# EAGLE design solenoid-shield (EAGLE 9.6.2)

## Sheet 1 of 3
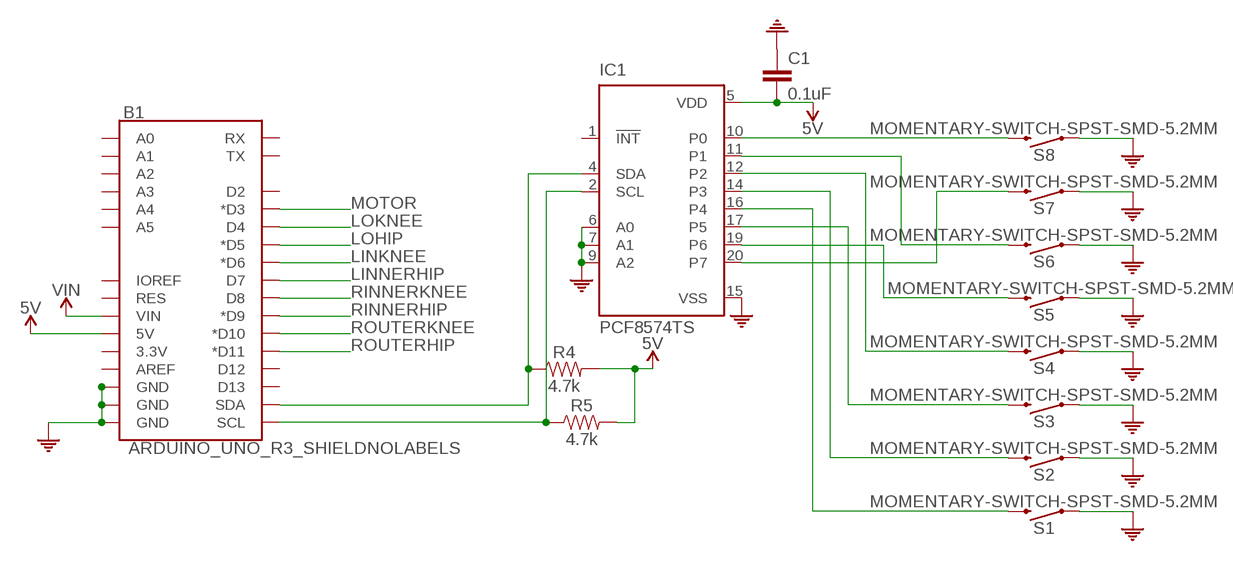
[diagram p0: schematic, sheet 1]

### Parts
B1  ARDUINO_UNO_R3_SHIELDNOLABELS  [UNO_R3_SHIELD_NOLABELS]
C1  0.1uF  0.1UF-0603-25V-5%  [0603]
IC1  PCF8574TS  [SSOP20]
R4  4.7k  4.7KOHM-0603-1/10W-1%  [0603]
R5  4.7k  4.7KOHM-0603-1/10W-1%  [0603]
S1  MOMENTARY-SWITCH-SPST-SMD-5.2MM  [TACTILE_SWITCH_SMD_5.2MM]
S2  MOMENTARY-SWITCH-SPST-SMD-5.2MM  [TACTILE_SWITCH_SMD_5.2MM]
S3  MOMENTARY-SWITCH-SPST-SMD-5.2MM  [TACTILE_SWITCH_SMD_5.2MM]
S4  MOMENTARY-SWITCH-SPST-SMD-5.2MM  [TACTILE_SWITCH_SMD_5.2MM]
S5  MOMENTARY-SWITCH-SPST-SMD-5.2MM  [TACTILE_SWITCH_SMD_5.2MM]
S6  MOMENTARY-SWITCH-SPST-SMD-5.2MM  [TACTILE_SWITCH_SMD_5.2MM]
S7  MOMENTARY-SWITCH-SPST-SMD-5.2MM  [TACTILE_SWITCH_SMD_5.2MM]
S8  MOMENTARY-SWITCH-SPST-SMD-5.2MM  [TACTILE_SWITCH_SMD_5.2MM]

### Nets
5V: B1.5V C1.2 IC1.5(VDD) R4.2 R5.2
COM: B1.GND@0(GND) B1.GND@1(GND) B1.GND@2(GND) C1.1 IC1.6(A0) IC1.7(A1) IC1.9(A2) IC1.15(VSS) S1.1 S2.1 S3.1 S4.1 S5.1 S6.1 S7.1 S8.1 ; also sheet 2
LINKNEE: B1.D6(*D6) ; also sheet 2
LINNERHIP: B1.D7 ; also sheet 2
LOHIP: B1.D5(*D5) ; also sheet 2
LOKNEE: B1.D4 ; also sheet 2
MOTOR: B1.D3(*D3) ; also sheet 2
N$9: IC1.10(P0) S8.3
N$11: IC1.20(P7) S7.3
N$13: B1.SDA IC1.4(SDA) R4.1
N$26: IC1.11(P1) S6.3
N$29: IC1.19(P6) S5.3
N$31: IC1.12(P2) S4.3
N$32: IC1.17(P5) S3.3
N$33: IC1.14(P3) S2.3
N$34: IC1.16(P4) S1.3
N$49: B1.SCL IC1.2(SCL) R5.1
RINNERHIP: B1.D9(*D9) ; also sheet 2
RINNERKNEE: B1.D8 ; also sheet 2
ROUTERHIP: B1.D11(*D11) ; also sheet 2
ROUTERKNEE: B1.D10(*D10) ; also sheet 2
VIN: B1.VIN ; also sheet 2
Unconnected: B1.3.3V B1.A0 B1.A1 B1.A2 B1.A3 B1.A4 B1.A5 B1.AREF B1.D2 B1.D12 B1.D13 B1.IOREF B1.RES B1.RX B1.TX IC1.1(!INT)

## Sheet 2 of 3
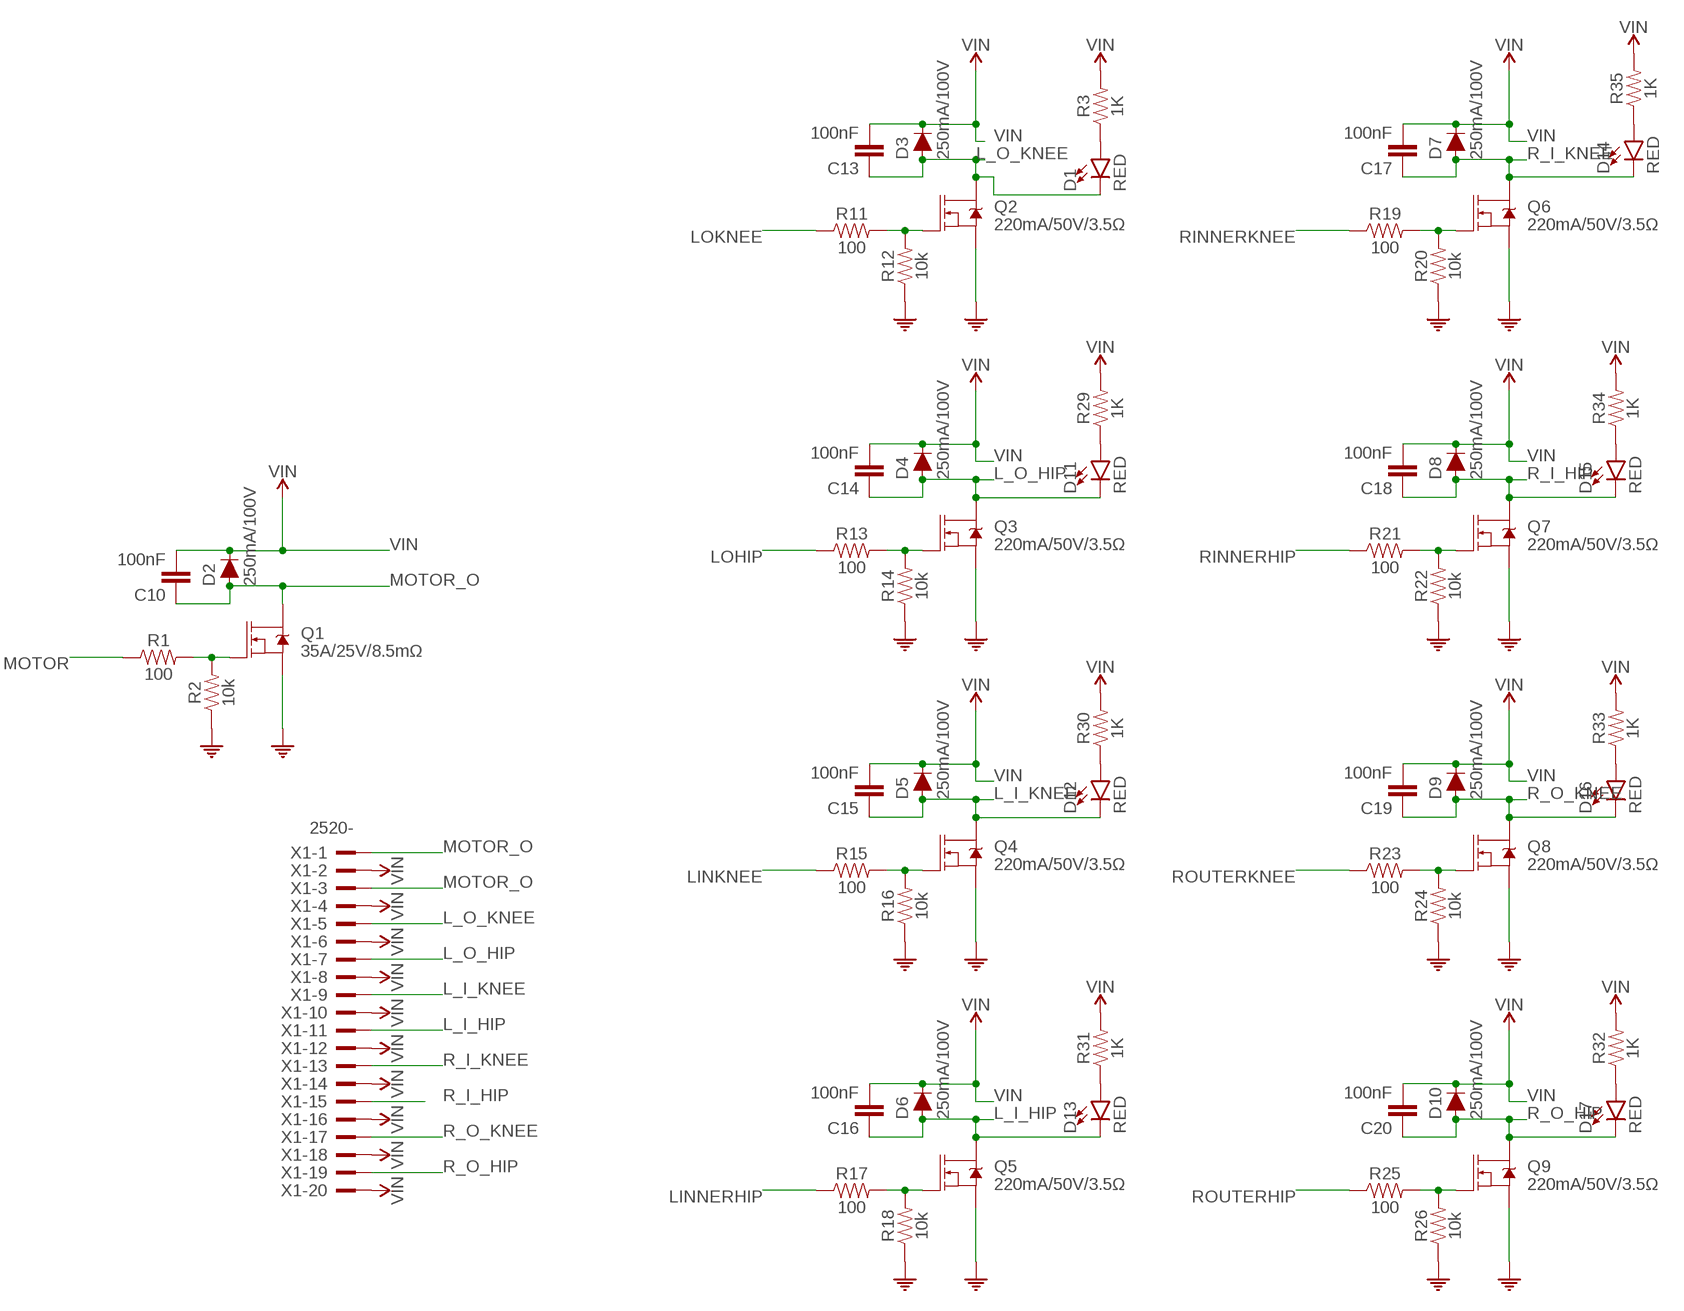
[diagram p1: schematic, sheet 2]

### Parts
C10  100nF  0015_100NF_0603  [C0603-ROUND]
C13  100nF  0015_100NF_0603  [C0603-ROUND]
C14  100nF  0015_100NF_0603  [C0603-ROUND]
C15  100nF  0015_100NF_0603  [C0603-ROUND]
C16  100nF  0015_100NF_0603  [C0603-ROUND]
C17  100nF  0015_100NF_0603  [C0603-ROUND]
C18  100nF  0015_100NF_0603  [C0603-ROUND]
C19  100nF  0015_100NF_0603  [C0603-ROUND]
C20  100nF  0015_100NF_0603  [C0603-ROUND]
D1  RED  LED-RED0603  [LED-0603]
D2  250mA/100V  DIODE-BAS16J  [SOD-323]
D3  250mA/100V  DIODE-BAS16J  [SOD-323]
D4  250mA/100V  DIODE-BAS16J  [SOD-323]
D5  250mA/100V  DIODE-BAS16J  [SOD-323]
D6  250mA/100V  DIODE-BAS16J  [SOD-323]
D7  250mA/100V  DIODE-BAS16J  [SOD-323]
D8  250mA/100V  DIODE-BAS16J  [SOD-323]
D9  250mA/100V  DIODE-BAS16J  [SOD-323]
D10  250mA/100V  DIODE-BAS16J  [SOD-323]
D11  RED  LED-RED0603  [LED-0603]
D12  RED  LED-RED0603  [LED-0603]
D13  RED  LED-RED0603  [LED-0603]
D14  RED  LED-RED0603  [LED-0603]
D15  RED  LED-RED0603  [LED-0603]
D16  RED  LED-RED0603  [LED-0603]
D17  RED  LED-RED0603  [LED-0603]
Q1  35A/25V/8.5mΩ  MOSFET-NCH-FDD8780  [DPAK]
Q2  220mA/50V/3.5Ω  MOSFET-NCH-BSS138  [SOT23-3]
Q3  220mA/50V/3.5Ω  MOSFET-NCH-BSS138  [SOT23-3]
Q4  220mA/50V/3.5Ω  MOSFET-NCH-BSS138  [SOT23-3]
Q5  220mA/50V/3.5Ω  MOSFET-NCH-BSS138  [SOT23-3]
Q6  220mA/50V/3.5Ω  MOSFET-NCH-BSS138  [SOT23-3]
Q7  220mA/50V/3.5Ω  MOSFET-NCH-BSS138  [SOT23-3]
Q8  220mA/50V/3.5Ω  MOSFET-NCH-BSS138  [SOT23-3]
Q9  220mA/50V/3.5Ω  MOSFET-NCH-BSS138  [SOT23-3]
R1  100  100OHM-0603-1/10W-1%  [0603]
R2  10k  10KOHM-0603-1/10W-1%  [0603]
R3  1K  10KOHM-0603-1/10W-1%  [0603]
R11  100  100OHM-0603-1/10W-1%  [0603]
R12  10k  10KOHM-0603-1/10W-1%  [0603]
R13  100  100OHM-0603-1/10W-1%  [0603]
R14  10k  10KOHM-0603-1/10W-1%  [0603]
R15  100  100OHM-0603-1/10W-1%  [0603]
R16  10k  10KOHM-0603-1/10W-1%  [0603]
R17  100  100OHM-0603-1/10W-1%  [0603]
R18  10k  10KOHM-0603-1/10W-1%  [0603]
R19  100  100OHM-0603-1/10W-1%  [0603]
R20  10k  10KOHM-0603-1/10W-1%  [0603]
R21  100  100OHM-0603-1/10W-1%  [0603]
R22  10k  10KOHM-0603-1/10W-1%  [0603]
R23  100  100OHM-0603-1/10W-1%  [0603]
R24  10k  10KOHM-0603-1/10W-1%  [0603]
R25  100  100OHM-0603-1/10W-1%  [0603]
R26  10k  10KOHM-0603-1/10W-1%  [0603]
R29  1K  10KOHM-0603-1/10W-1%  [0603]
R30  1K  10KOHM-0603-1/10W-1%  [0603]
R31  1K  10KOHM-0603-1/10W-1%  [0603]
R32  1K  10KOHM-0603-1/10W-1%  [0603]
R33  1K  10KOHM-0603-1/10W-1%  [0603]
R34  1K  10KOHM-0603-1/10W-1%  [0603]
R35  1K  10KOHM-0603-1/10W-1%  [0603]
X1  2520-  [PAK100/2500-20]

### Nets
COM: Q1.3(S) Q2.2(S) Q3.2(S) Q4.2(S) Q5.2(S) Q6.2(S) Q7.2(S) Q8.2(S) Q9.2(S) R2.1 R12.1 R14.1 R16.1 R18.1 R20.1 R22.1 R24.1 R26.1 ; also sheet 1
L_I_HIP: C16.1 D6.A D13.C Q5.3(D) X1.11
L_I_KNEE: C15.1 D5.A D12.C Q4.3(D) X1.9
L_O_HIP: C14.1 D4.A D11.C Q3.3(D) X1.7
L_O_KNEE: C13.1 D1.C D3.A Q2.3(D) X1.5
LINKNEE: R15.1 ; also sheet 1
LINNERHIP: R17.1 ; also sheet 1
LOHIP: R13.1 ; also sheet 1
LOKNEE: R11.1 ; also sheet 1
MOTOR: R1.1 ; also sheet 1
MOTOR_O: C10.1 D2.A Q1.4(D) X1.1 X1.3
N$1: D1.A R3.1
N$2: D11.A R29.1
N$3: D12.A R30.1
N$4: D13.A R31.1
N$5: D17.A R32.1
N$6: D16.A R33.1
N$7: D15.A R34.1
N$8: D14.A R35.1
N$10: Q1.1(G) R1.2 R2.2
N$12: Q2.1(G) R11.2 R12.2
N$15: Q3.1(G) R13.2 R14.2
N$17: Q4.1(G) R15.2 R16.2
N$19: Q5.1(G) R17.2 R18.2
N$21: Q6.1(G) R19.2 R20.2
N$23: Q7.1(G) R21.2 R22.2
N$25: Q8.1(G) R23.2 R24.2
N$28: Q9.1(G) R25.2 R26.2
R_I_HIP: C18.1 D8.A D15.C Q7.3(D) X1.15
R_I_KNEE: C17.1 D7.A D14.C Q6.3(D) X1.13
R_O_HIP: C20.1 D10.A D17.C Q9.3(D) X1.19
R_O_KNEE: C19.1 D9.A D16.C Q8.3(D) X1.17
RINNERHIP: R21.1 ; also sheet 1
RINNERKNEE: R19.1 ; also sheet 1
ROUTERHIP: R25.1 ; also sheet 1
ROUTERKNEE: R23.1 ; also sheet 1
VIN: C10.2 C13.2 C14.2 C15.2 C16.2 C17.2 C18.2 C19.2 C20.2 D2.C D3.C D4.C D5.C D6.C D7.C D8.C D9.C D10.C R3.2 R29.2 R30.2 R31.2 R32.2 R33.2 R34.2 R35.2 X1.2 X1.4 X1.6 X1.8 X1.10 X1.12 X1.14 X1.16 X1.18 X1.20 ; also sheet 1

## Sheet 3 of 3

## Library data of the parts
B1 = SparkFun-Boards:ARDUINO_UNO_R3_SHIELD: Arduino R3 Shield Footprint Shield form compatible with the Arduino Uno R3. SparkFun Products: MG2639 Cellular Shield <https://www.sparkfun.com/products/13120> MIDI Shield <https://www.sparkfun.com/products/12898> R3 Stackable Headers Kit <https://www.sparkfun.com/products/11417>
C1 = SparkFun-Capacitors:0.1UF: 0.1µF ceramic capacitors A capacitor is a passive two-terminal electrical component used to store electrical energy temporarily in an electric field.; PROD_ID: CAP-08604
C10 C13-C20 = Condensatori:0015_100NF_0603: 100nF 0603 50V; CASE: 0603; MONTHLY_USAGE: _____; PART_NUMBER: cl10b104kbnc; PRICE: _____; SUPPLIER: _____; TYPE: Condensatori
D1 D11-D17 = SparkFun-LED:LED-RED: Red SMD LED Used in manufacturing of most products at SparkFun Packages: 0603 - SMD 0603 package [Product Link] <http://docs.avagotech.com/docs/AV02-0551EN> 0603 SMART - SMD 0603 SMART package ( more efficient and expensive)[Product Link] <http://www.osram-os.com/Graphics/XPic2/00077099_0.pdf> 1206 - SMD1206 package [Product Link] <https://www.sparkfun.com/datasheets/DevTools/LilyPad/Q150OVS4.pdff> SparkFun Products: Pro Mini 328 -5V <https://www.sparkfun.com/products/821> RedBoard <https://www.sparkfun.com/products/12757> IOIO-OTG <https://www.sparkfun.com/products/13613>; PROD_ID: DIO-00819
D2-D10 = SparkFun-DiscreteSemi:DIODE: Diode These are standard reverse protection diodes and small signal diodes. SparkFun Products: SparkFun SparkPunk Sound Kit <https://www.sparkfun.com/products/11177> SparkFun ESP8266 Thing <https://www.sparkfun.com/products/13231>; PROD_ID: DIO-09646
IC1 = micro-philips:PCF8574: I2C-Bus Remote 8-bit I/O expander http://www.semiconductors.philips.com/acrobat_download/datasheets/PCF8574_4.pdf; MPN: PCF8574TS/3,118; OC_FARNELL: 1506644; OC_NEWARK: 70R6873
Q1 = SparkFun-DiscreteSemi:MOSFET-NCH: N-channel MOSFETs Voltage controlled devices that allow control of high current outputs. SparkFun Products: SparkFun OpenScale <https://www.sparkfun.com/products/13261> SparkFun Digital Sandbox <https://www.sparkfun.com/products/12651> SparkFun Monster Moto Shield <https://www.sparkfun.com/products/10182> SparkFun MOSFET Power Controller <https://www.sparkfun.com/products/11214>; PROD_ID: TRANS-09984
Q2-Q9 = SparkFun-DiscreteSemi:MOSFET-NCH: N-channel MOSFETs Voltage controlled devices that allow control of high current outputs. SparkFun Products: SparkFun OpenScale <https://www.sparkfun.com/products/13261> SparkFun Digital Sandbox <https://www.sparkfun.com/products/12651> SparkFun Monster Moto Shield <https://www.sparkfun.com/products/10182> SparkFun MOSFET Power Controller <https://www.sparkfun.com/products/11214>; PROD_ID: TRANS-00830
R1 R11 R13 R15 R17 R19 R21 R23 R25 = SparkFun-Resistors:100OHM: 100Ω resistor A resistor is a passive two-terminal electrical component that implements electrical resistance as a circuit element. Resistors act to reduce current flow, and, at the same time, act to lower voltage levels within circuits. - Wikipedia; PROD_ID: RES-07863
R2 R12 R14 R16 R18 R20 R22 R24 R26 = SparkFun-Resistors:10KOHM: 10kΩ resistor A resistor is a passive two-terminal electrical component that implements electrical resistance as a circuit element. Resistors act to reduce current flow, and, at the same time, act to lower voltage levels within circuits. - Wikipedia; PROD_ID: RES-00824
R3 R29-R35 = SparkFun-Resistors:10KOHM: 10kΩ resistor A resistor is a passive two-terminal electrical component that implements electrical resistance as a circuit element. Resistors act to reduce current flow, and, at the same time, act to lower voltage levels within circuits. - Wikipedia; PROD_ID: RES-00824; VALUE: 10k
R4 R5 = SparkFun-Resistors:4.7KOHM: 4.7kΩ resistor A resistor is a passive two-terminal electrical component that implements electrical resistance as a circuit element. Resistors act to reduce current flow, and, at the same time, act to lower voltage levels within circuits. - Wikipedia; PROD_ID: RES-07857
S1-S8 = SparkFun-Switches:MOMENTARY-SWITCH-SPST: Momentary Switch (Pushbutton) - SPST Normally-open (NO) SPST momentary switches (buttons, pushbuttons). Variants PTH-12MM - 12mm square, through-hole Momentary Pushbutton Switch - 12mm Square <https://www.sparkfun.com/products/9190> (COM-09190) PTH-6.0MM, PTH-6.0MM-KIT - 6.0mm square, through-hole Mini Pushbutton Switch <https://www.sparkfun.com/products/97> (COM-00097) KIT package intended for soldering kit's - only one side of pads' copper is exposed. PTH-RIGHT-ANGLE-KIT - Right-angle, through-hole Right Angle Tactile Button <https://www.sparkfun.com/products/10791> - Used on SparkFun BigTime Watch Kit <https://www.sparkfun.com/products/11734> SMD-12MM - 12mm square, surface-mount Tactile Button - SMD (12mm) <https://www.sparkfun.com/products/12993> (COM-12993) Used on SparkFun PicoBoard <https://www.sparkfun.com/products/11888> SMD-4.5MM - 4.5mm Square Trackball Switch Used on SparkFun Blackberry Trackballer Breakout <https://www.sparkfun.com/products/13169> SMD-4.6MMX2.8MM - 4.60mm x 2.80mm, surface mount Used on SparkFun SAMD21 Mini Breakout <https://www.sparkfun.com/products/13664> SMD-5.2MM, SMD-5.2-REDUNDANT - 5.2mm square, surface-mount Mini Pushbutton Switch - SMD <https://www.sparkfun.com/products/8720> (COM-08720) Used on Arduino Pro Mini <https://www.sparkfun.com/products/11114> REDUNDANT package connects both switch circuits together SMD-6.0X3.5MM - 6.0 x 3.5mm, surface mount Momentary Reset Switch SMD <https://www.sparkfun.com/products/8229> (COM-08229) SMD-6.2MM-TALL - 6.2mm square, surface mount Tactile Button - SMD (6mm) <https://www.sparkfun.com/products/12992> Used on SparkFun Digital Sandbox <https://www.sparkfun.com/products/12651> SMD-RIGHT-ANGLE - Right-angle, surface mount Used on SparkFun Block for Intel® Edison - Arduino <https://www.sparkfun.com/products/13036>; PROD_ID: SWCH-08247; SF_SKU: COM-08720
X1 = con-3m:2520-: 3M (TM) Pak 100 4-Wall Header Source: 3M; OC_FARNELL: unknown; OC_NEWARK: unknown

## Board
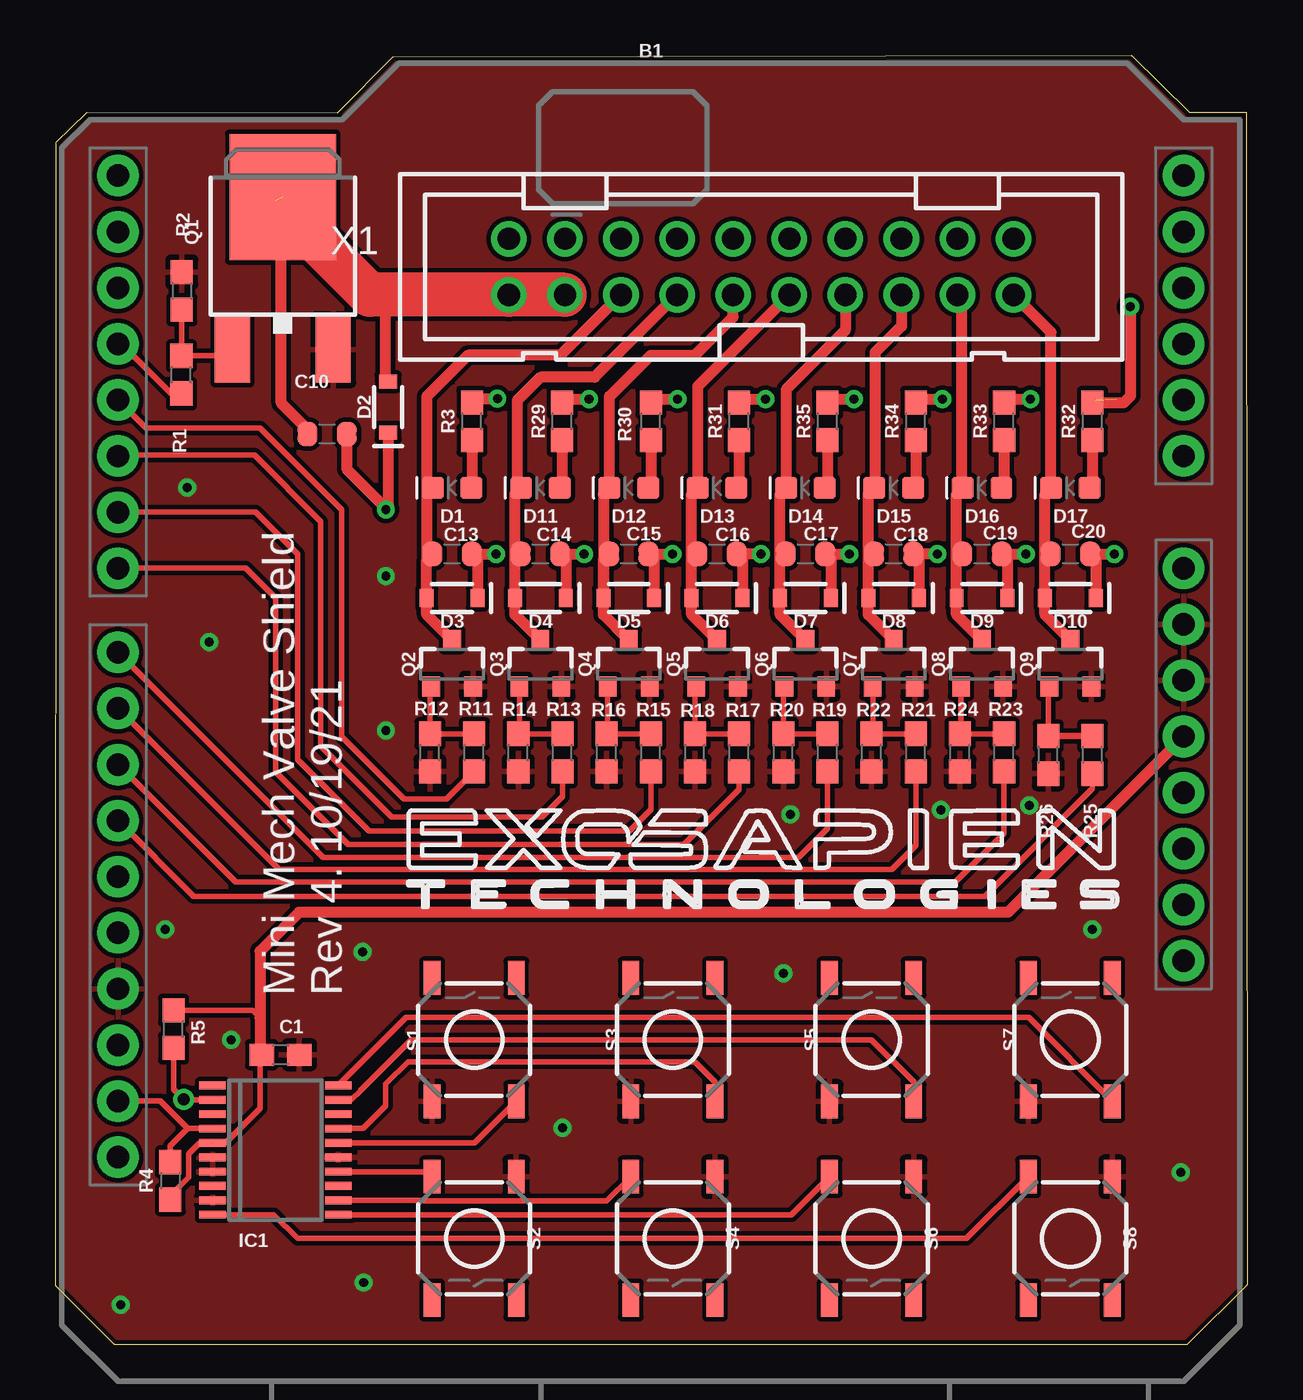
[diagram p2: board, top side]
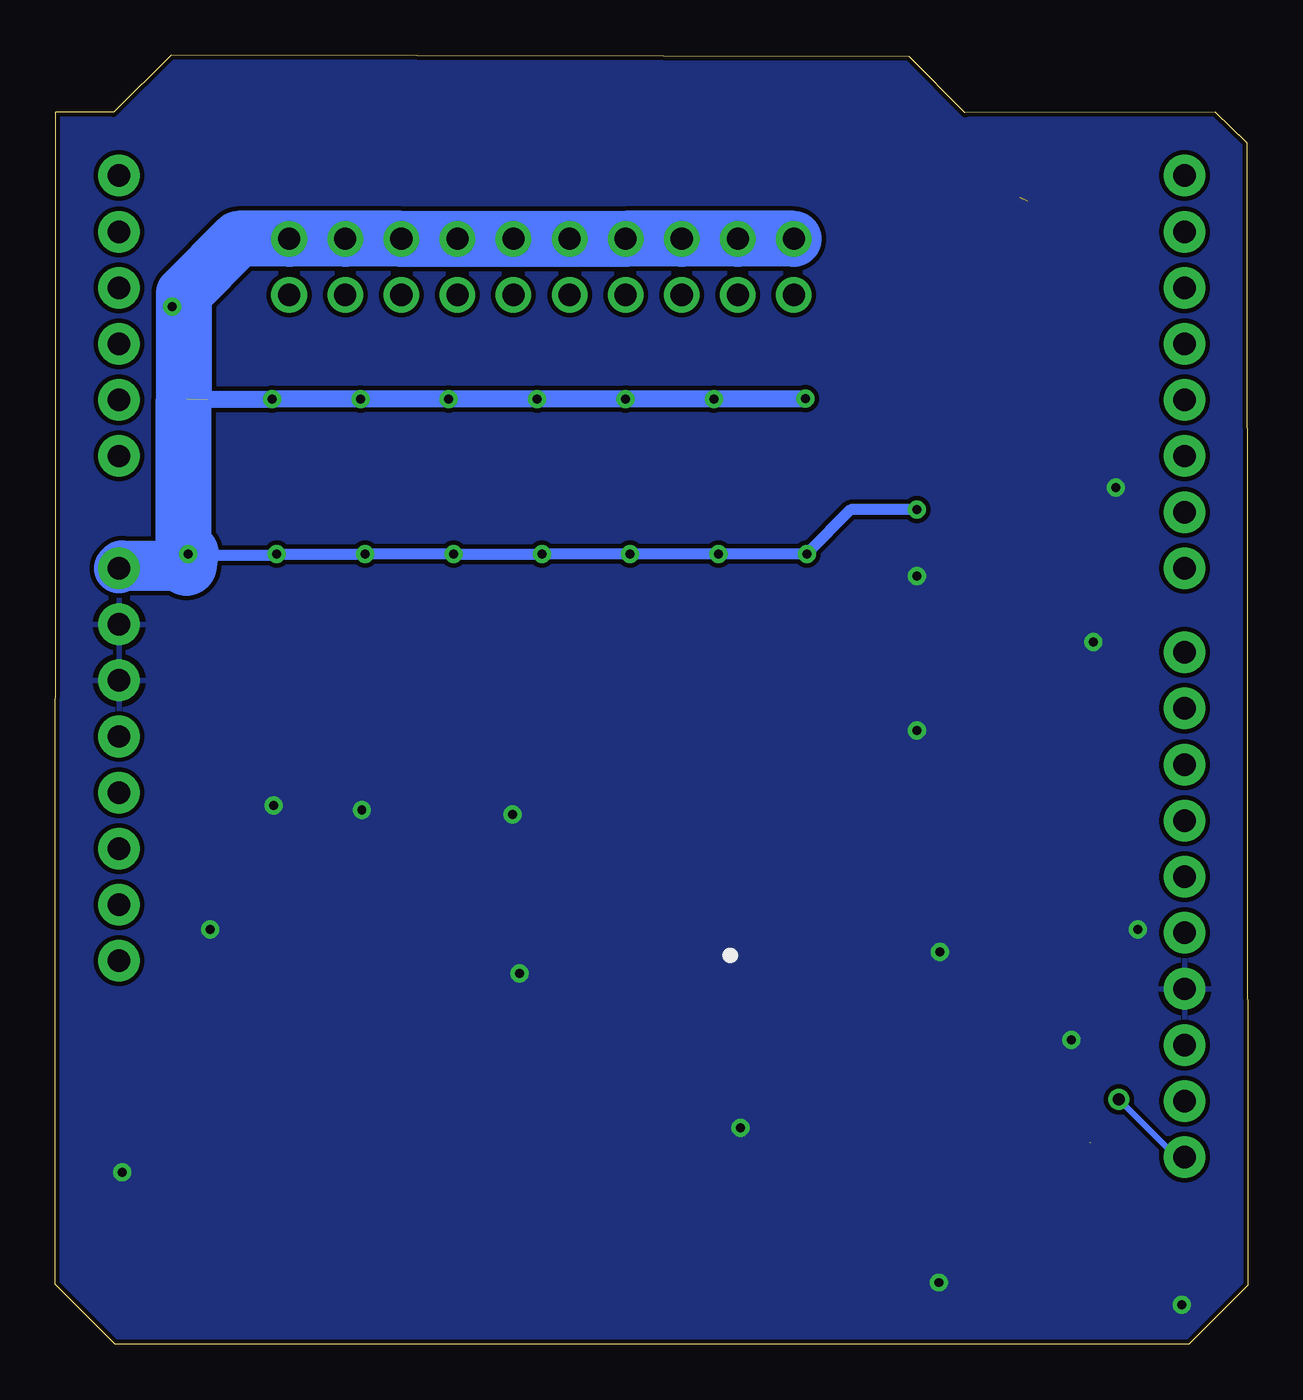
[diagram p3: board, bottom side, seen from below]

Size 54 x 58.38 mm. Coordinates in mm from the lower left corner, seen from the top.
Outline: 0.03,54.42 0,2.67 2.67,0 51.28,0 54,2.72 53.97,55.8 51.36,55.8 48.75,58.38 15.3,58.3 12.8,55.77 1.46,55.8 0.03,54.42
Copper layers (1*16): Top 0.035mm / dielectric 1.5mm / Bottom 0.035mm
Design rules "default *": minimum track width 10mil, minimum drill 16mil, track to track 8mil, track to pad 8mil, pad to pad 8mil, via to via 8mil, smd to smd 8mil, copper to edge 8mil, drill to drill 8mil, minimum pad ring 12mil, minimum via ring 8mil, stop-mask expansion 0mil, vias tented up to drill 24mil, thermal gap 10mil

### Footprints (pad centres in the part's own frame; a part is rotated, then mirrored left to right if it is on the bottom)
UNO_R3_SHIELD_NOLABELS = drill 1.016 pad 1.88: 3.3V 24.13,-3.81; 5V 24.13,-1.27; A0 24.13,11.43; A1 24.13,13.97; A2 24.13,16.51; A3 24.13,19.05; A4 24.13,21.59; A5 24.13,24.13; AREF -24.13,-15.24; D2 -24.13,19.05; D3 -24.13,16.51; D4 -24.13,13.97; D5 -24.13,11.43; D6 -24.13,8.89; D7 -24.13,6.35; D8 -24.13,2.54; D9 -24.13,0; D10 -24.13,-2.54; D11 -24.13,-5.08; D12 -24.13,-7.62; D13 -24.13,-10.16; GND@0 24.13,1.27; GND@1 24.13,3.81; GND@2 -24.13,-12.7; IOREF 24.13,-8.89; NC 24.13,-11.43; RES 24.13,-6.35; RX -24.13,24.13; SCL -24.13,-20.32; SDA -24.13,-17.78; TX -24.13,21.59; VIN 24.13,6.35
0603 = smd 1.1 x 1: 1 -0.85,0; 2 0.85,0
C0603-ROUND = smd 0.898 x 1.1: 1 -0.889,0; 2 0.889,0
LED-0603 = smd 1 x 1: A -0.877,0; C 0.877,0
SOD-323 = smd 0.63 x 0.83: A 1.15,0; C -1.15,0
SSOP20 = smd 0.35 x 1.2: 1 -2.925,-2.85; 2 -2.275,-2.85; 3 -1.625,-2.85; 4 -0.975,-2.85; 5 -0.325,-2.85; 6 0.325,-2.85; 7 0.975,-2.85; 8 1.625,-2.85; 9 2.275,-2.85; 10 2.925,-2.85; 11 2.925,2.85; 12 2.275,2.85; 13 1.625,2.85; 14 0.975,2.85; 15 0.325,2.85; 16 -0.325,2.85; 17 -0.975,2.85; 18 -1.625,2.85; 19 -2.275,2.85; 20 -2.925,2.85
DPAK = smd 1.6 x 3: 1 -2.28,-5.31; 3 2.28,-5.31 | smd 4.826 x 5.715: 4 0,1.588
SOT23-3 = smd 0.8 x 0.9: 1 -0.95,-1; 2 0.95,-1; 3 0,1.1
TACTILE_SWITCH_SMD_5.2MM = smd 1.524 x 0.762: 1 -2.794,1.905; 2 2.794,1.905; 3 -2.794,-1.905; 4 2.794,-1.905
PAK100/2500-20 = drill 1 pad 1.422: 1 -11.43,-1.27; 2 -11.43,1.27; 3 -8.89,-1.27; 4 -8.89,1.27; 5 -6.35,-1.27; 6 -6.35,1.27; 7 -3.81,-1.27; 8 -3.81,1.27; 9 -1.27,-1.27; 10 -1.27,1.27; 11 1.27,-1.27; 12 1.27,1.27; 13 3.81,-1.27; 14 3.81,1.27; 15 6.35,-1.27; 16 6.35,1.27; 17 8.89,-1.27; 18 8.89,1.27; 19 11.43,-1.27; 20 11.43,1.27

### Placement (x,y rotation side)
B1  26.97,28.8 0 top
C1  10.21,13.12 180 top
C10  12.31,41.22 0 top
C13  17.97,35.8 0 top
C14  21.97,35.8 0 top
C15  25.97,35.8 0 top
C16  29.97,35.8 0 top
C17  33.97,35.8 0 top
C18  37.97,35.8 0 top
C19  41.97,35.8 0 top
C20  45.97,35.8 0 top
D1  17.97,38.8 180 top
D2  15.07,42.45 90 top
D3  17.97,33.8 180 top
D4  21.97,33.8 180 top
D5  25.97,33.8 180 top
D6  29.97,33.8 180 top
D7  33.97,33.8 180 top
D8  37.97,33.8 180 top
D9  41.97,33.8 180 top
D10  45.97,33.8 180 top
D11  21.97,38.8 180 top
D12  25.97,38.8 180 top
D13  29.97,38.8 180 top
D14  33.97,38.8 180 top
D15  37.97,38.8 180 top
D16  41.97,38.8 180 top
D17  45.97,38.8 180 top
IC1  9.97,8.8 270 top
Q1  10.31,50.36 0 top
Q2  17.97,30.8 0 top
Q3  21.97,30.8 0 top
Q4  25.97,30.8 0 top
Q5  29.97,30.8 0 top
Q6  33.97,30.8 0 top
Q7  37.97,30.8 0 top
Q8  41.97,30.8 0 top
Q9  45.97,30.8 0 top
R1  5.72,43.91 90 top
R2  5.74,47.71 270 top
R3  18.87,41.8 90 top
R4  5.21,7.41 270 top
R5  5.36,14.27 90 top
R11  18.97,26.8 90 top
R12  16.97,26.8 90 top
R13  22.97,26.8 90 top
R14  20.97,26.8 90 top
R15  26.97,26.8 90 top
R16  24.97,26.8 90 top
R17  30.97,26.8 90 top
R18  28.97,26.8 90 top
R19  34.97,26.8 90 top
R20  32.97,26.8 90 top
R21  38.97,26.8 90 top
R22  36.97,26.8 90 top
R23  42.97,26.8 90 top
R24  40.97,26.8 90 top
R25  46.97,26.7 90 top
R26  44.97,26.7 90 top
R29  22.96,41.8 90 top
R30  26.97,41.8 90 top
R31  30.97,41.8 90 top
R32  46.97,41.8 90 top
R33  42.97,41.8 90 top
R34  38.97,41.8 90 top
R35  34.97,41.8 90 top
S1  18.97,13.8 90 top
S2  18.97,4.8 270 top
S3  27.97,13.8 90 top
S4  27.97,4.8 270 top
S5  36.97,13.8 90 top
S6  36.97,4.8 270 top
S7  45.97,13.8 90 top
S8  45.97,4.8 270 top
X1  31.97,48.8 0 top

### Tracks (layer width: path | path; a pad name or v marks a point on that pad's centre or on a via)
5V  (1 unrouted)
  Top 0.254: IC1.5 7.71,9.11 9.27,10.68 9.27,13.2 | R5.2 8.95,15.12 9.27,14.8 | R4.2 5.21,6.74 6.04,7.57 6.04,8.63 6.54,9.13 6.97,9.13 IC1.5
  Top 0.508: B1.5V 43.15,19.57 11.04,19.57 9.27,17.8 9.27,14.8 9.27,13.2 C1.2
COM  (via drill 0.41)
  other vias: 6.97,31.8 14.97,34.8 40.11,24.2 32.97,16.8 33.3,23.99 44.11,24.4 4.97,18.8 13.93,17.77 46.97,18.8 2.97,1.8 5.97,38.8 14.97,27.8 7.97,13.8 22.97,9.8 13.97,2.8 50.97,7.8
  pour Top (isolate 0.203): -0.57,60.1 54.67,60.1 54.67,-5.3 -0.57,-5.41
  pour Bottom (isolate 0.203): -0.57,60.35 56.62,60.35 56.62,-5.3 -0.57,-5.43
L_I_HIP
  Top 0.508: Q5.3 28.82,33.05 D6.A | D6.A 28.82,38.52 D13.C 29.1,43.38 X1.11 | D6.A 28.82,35.54 C16.1
L_I_KNEE
  Top 0.508: Q4.3 24.82,33.05 D5.A | D5.A 24.82,38.52 D12.C 25.1,42.92 26.97,44.8 28.97,44.8 30.7,46.53 X1.9 | D5.A 24.82,35.54 C15.1
L_O_HIP
  Top 0.254: D4.A 20.82,35.54 C14.1
  Top 0.508: Q3.3 20.82,33.05 D4.A 20.82,38.52 D11.C 20.92,38.97 20.92,42.74 21.97,43.8 24.43,43.8 X1.7
L_O_KNEE
  Top 0.508: Q2.3 16.82,33.05 D3.A 16.82,35.54 | 16.82,35.54 C13.1 | D1.C 16.82,38.52 | 16.82,38.52 16.82,35.54 | 16.82,38.52 16.82,42.93 18.7,44.8 22.89,44.8 X1.5
LINKNEE
  Top 0.254: R15.1 26.97,24.23 26,23.26 14.21,23.26 10.97,26.49 10.97,35.8 9.08,37.69 B1.D6
LINNERHIP
  Top 0.254: R17.1 30.97,25.13 28.48,22.64 13.26,22.64 9.97,25.93 9.97,33.8 8.63,35.15 B1.D7
LOHIP
  Top 0.254: R13.1 22.97,24.8 22.05,23.88 15.24,23.88 12.03,27.09 12.03,37.26 9.02,40.27 2.88,40.27 B1.D5
LOKNEE
  Top 0.254: R11.1 17.73,24.7 15.8,24.7 12.97,27.52 12.97,37.8 9.28,41.49 4.12,41.49 B1.D4
MOTOR
  Top 0.254: B1.D3 3,45.31 5.25,43.06 R1.1
MOTOR_O  (1 unrouted)
  Top 0.508: 10.73,51.53 Q1.4 10.24,52.02 10.24,42.61 11.42,41.43 C10.1 | D2.A 14.97,43.7 14.97,47.53
  Top 2: X1.3 X1.1 14.97,47.53 14.24,47.53 9.97,51.8
N$1
  Top 0.508: R3.1 18.87,38.82 D1.A
N$2
  Top 0.508: R29.1 22.96,38.91 D11.A
N$3
  Top 0.508: R30.1 26.97,38.92 D12.A
N$4
  Top 0.508: R31.1 30.97,38.92 D13.A
N$5
  Top 0.508: R32.1 46.97,38.92 D17.A
N$6
  Top 0.508: R33.1 42.97,38.92 D16.A
N$7
  Top 0.508: R34.1 38.97,38.92 D15.A
N$8
  Top 0.508: R35.1 34.97,38.92 D14.A
N$9
  Top 0.254: IC1.10 9.9,5.87 10.97,4.8 41.28,4.8 S8.3
N$10
  Top 0.254: R2.2 5.74,44.78 | 5.74,44.78 R1.2 | Q1.1 7.76,44.78 5.74,44.78
N$11
  Top 0.254: S7.3 44.09,14.8 15.9,14.8 IC1.20
N$12
  Top 0.254: R11.2 R12.2 16.97,29.75 Q2.1
N$13
  Top 0.254: B1.SDA 4.75,11.02 6,9.77 | 6,9.77 IC1.4 | R4.1 5.21,8.98 6,9.77
N$15
  Top 0.254: R13.2 R14.2 21.02,27.7 Q3.1
N$17
  Top 0.254: Q4.1 25.02,27.7 R16.2 R15.2
N$19
  Top 0.254: R17.2 R18.2 28.97,29.75 Q5.1
N$21
  Top 0.254: R19.2 33.07,27.65 33.02,27.7 R20.2 32.97,29.75 Q6.1
N$23
  Top 0.254: 37.17,27.65 R21.2 | Q7.1 37.02,27.7 R22.2
  Top 0.508: R22.2 37.17,27.65
N$25
  Top 0.254: 41.17,27.65 R23.2 | Q8.1 41.02,27.7 R24.2
  Top 0.508: R24.2 41.17,27.65
N$26
  Top 0.254: IC1.11 33.35,5.87 S6.3
N$28
  Top 0.254: Q9.1 44.97,29.75 R26.2
  Top 0.305: R25.2 R26.2
N$29
  Top 0.254: S5.3 38.88,11.89 36.97,13.8 16.13,13.8 13.83,11.5 13.83,11.49 13.43,11.09 12.84,11.09 IC1.19
N$31
  Top 0.254: IC1.12 16.53,6.52 16.55,6.5 24.98,6.5 S4.3
N$32
  Top 0.254: S3.3 29.88,11.89 28.97,12.8 15.97,12.8 14.97,11.8 14.97,10.8 13.95,9.77 IC1.17
N$33
  Top 0.254: IC1.14 16.84,7.82 S2.3
N$34
  Top 0.254: S1.3 19,9.12 IC1.16
N$49  (via drill 0.55)
  Top 0.254: IC1.2 5.84,11.07 v5.83,11.09 5.36,11.55 R5.1
  Bottom 0.254: B1.SCL 3.21,8.48 v5.83,11.09
R_I_HIP
  Top 0.508: Q7.3 36.82,33.05 D8.A 36.82,35.8 | 36.82,35.8 36.82,38.52 D15.C 37.13,38.83 37.13,44.91 38.32,46.11 X1.15 | C18.1 36.82,35.8
R_I_KNEE
  Top 0.508: Q6.3 32.82,33.05 D7.A 32.82,35.8 | 32.82,35.8 32.82,38.52 D14.C 33.1,43.23 35.78,45.92 X1.13 | C17.1 32.82,35.8
R_O_HIP
  Top 0.508: Q9.3 44.82,33.05 D10.A | D10.A 44.82,38.52 D17.C 45.1,45.83 X1.19 | D10.A 44.82,35.54 C20.1
R_O_KNEE
  Top 0.508: Q8.3 40.82,33.05 D9.A | D9.A 40.82,38.52 D16.C 41.06,38.84 41.06,47.33 X1.17 | D9.A 40.82,35.54 C19.1
RINNERHIP
  Top 0.254: R21.1 38.97,22.59 37.89,21.5 10.14,21.5 B1.D9
RINNERKNEE
  Top 0.254: B1.D8 12.14,22.04 33.66,22.04 34.97,23.36 R19.1
ROUTERHIP
  Top 0.254: B1.D11 6.27,20.29 42.1,20.29 46.97,25.16 R25.1
ROUTERKNEE
  Top 0.254: R23.1 42.97,23.13 40.78,20.93 8.17,20.93 B1.D10
VIN  (via drill 0.41)  (1 unrouted)
  Top 0.508: D4.C 23.12,35.54 C14.2 v23.96,35.8 v23.97,35.8 | D3.C 19.12,35.54 C13.2 v19.96,35.8 | D5.C 27.12,35.54 C15.2 v27.96,35.8 | D6.C 31.12,35.54 C16.2 v31.96,35.8 | D7.C 35.12,35.54 C17.2 v35.96,35.8 | D8.C 39.12,35.54 C18.2 v39.96,35.8 | v43.96,35.8 C19.2 43.12,35.54 D9.C | D10.C 47.12,35.54 C20.2 v47.97,35.8 | R3.2 19.05,42.82 v20.02,42.82 | R29.2 23.11,42.8 v24.17,42.8 | R30.2 27.12,42.8 v28.17,42.8 | R31.2 31.12,42.8 v32.17,42.8 | R35.2 35.12,42.8 v36.17,42.8 | R34.2 39.12,42.8 v40.17,42.8 | R33.2 43.12,42.8 v44.17,42.8 | C10.2 13.2,39.65 14.97,37.87 v14.97,37.8 15.07,37.9 D2.C | 47.1,42.77 R32.2 48.39,42.65 48.69,42.95 v48.69,47
  Bottom 0.254: X1.4 X1.8 X1.10
  Bottom 0.508: 24.15,42.82 v24.17,42.8 | v36.17,42.8 36,42.82 | 39.95,42.82 v40.17,42.8 | v14.97,37.8 17.97,37.8 19.96,35.81 v19.96,35.8 v23.96,35.8 v27.96,35.8 v31.96,35.8 | v31.96,35.8 v31.97,35.8 | v31.96,35.8 v35.96,35.8 v39.96,35.8 | v39.96,35.8 v39.97,35.8 | v39.96,35.8 v43.96,35.8 44.01,35.75 47.92,35.75 v47.97,35.8 | v48.69,47 48.18,46.48 48.18,42.8
  Bottom 0.768: 24.15,42.82 v20.02,42.82 | v24.17,42.8 v28.17,42.8 v32.17,42.8 v36.17,42.8 | 39.95,42.82 36,42.82 | v40.17,42.8 v44.17,42.8 48.05,42.8
  Bottom 2.27: 48.05,35.27 50.98,35.27 B1.VIN
  Bottom 2.54: X1.2 X1.4 X1.6 X1.8 X1.12 X1.14 X1.16 X1.18 X1.20 45.7,50.07 48.18,47.59 48.18,42.8 48.18,35.85 48.05,35.72
  Bottom 2.76: 48.05,35.87 v47.97,35.8 48.05,35.72 48.05,35.27

### Text on the board
tNames: Mini Mech Valve Shield / Rev 4. 10/19/21
test-probe: NANO / TEST POINTS | 10 | 9 | 8 | 7 | 6 | 5 | 4 | 3 | 2 | GND1 | RESET | 0 | 1 | USB_D- | USB_D+ | USB_GND | ISP1_5 | ISP1_4 | ISP1_3 | USB_5V | ISP1_1 | 3V3 | AREF | A0 | A1 | A2 | A3 | A4 | A5 | A6 | A7 | 5V_REF | DC_VIN- | DC_VIN+